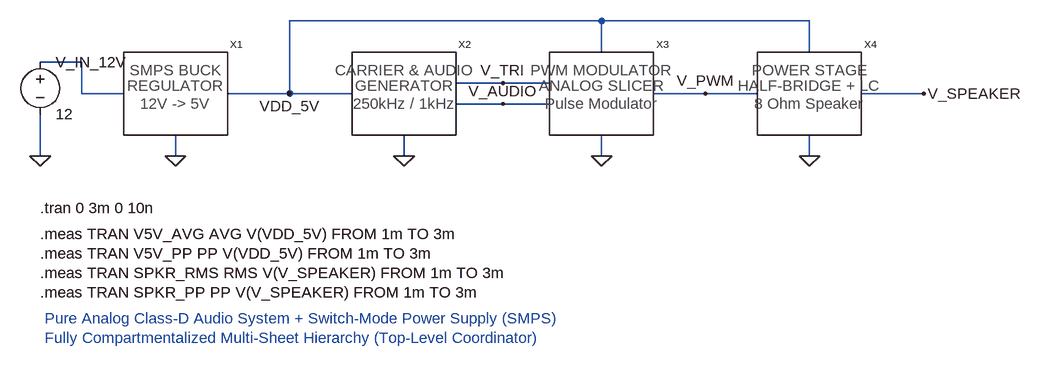
[diagram p0: schematic top_class_d.asc]
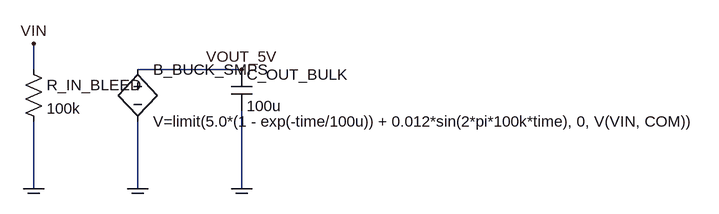
[diagram p1: sub-circuit smps_buck.asc]
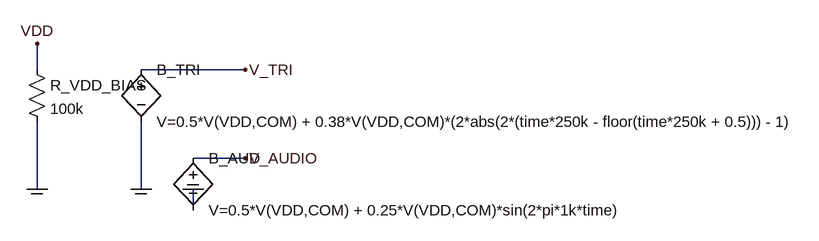
[diagram p2: sub-circuit carrier_gen.asc]
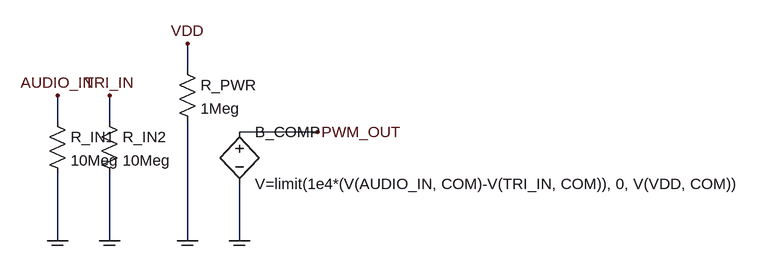
[diagram p3: sub-circuit pwm_modulator.asc]
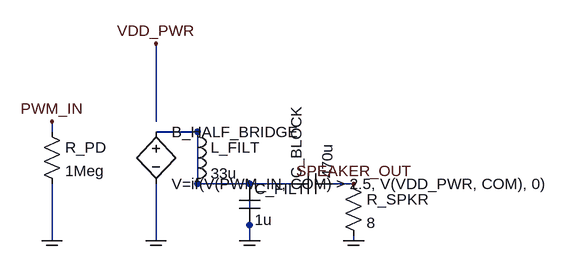
[diagram p4: sub-circuit power_stage.asc]
top_class_d.asc, the LTspice schematic file:
Version 4
SHEET 1 1600 1000
WIRE 80 256 144 256
WIRE 144 256 144 304
WIRE 144 304 208 304
SYMBOL voltage 80 240 R0
SYMATTR InstName V_IN_12V
SYMATTR Value 12
WIRE 80 336 80 400
FLAG 80 400 0
SYMBOL smps_buck 288 304 R0
SYMATTR InstName X1
WIRE 288 368 288 400
FLAG 288 400 0
WIRE 368 304 464 304
FLAG 464 304 VDD_5V
WIRE 464 304 560 304
SYMBOL carrier_gen 640 304 R0
SYMATTR InstName X2
WIRE 640 368 640 400
FLAG 640 400 0
WIRE 720 288 864 288
FLAG 792 288 V_TRI
WIRE 720 320 864 320
FLAG 792 320 V_AUDIO
WIRE 944 240 944 192
WIRE 944 192 464 192
WIRE 464 192 464 304
SYMBOL pwm_modulator 944 304 R0
SYMATTR InstName X3
WIRE 944 368 944 400
FLAG 944 400 0
WIRE 1024 304 1184 304
FLAG 1104 304 V_PWM
WIRE 1264 240 1264 192
WIRE 1264 192 944 192
SYMBOL power_stage 1264 304 R0
SYMATTR InstName X4
WIRE 1264 368 1264 400
FLAG 1264 400 0
WIRE 1344 304 1440 304
FLAG 1440 304 V_SPEAKER
TEXT 80 480 Left 2 !.tran 0 3m 0 10n
TEXT 80 520 Left 2 !.meas TRAN V5V_AVG AVG V(VDD_5V) FROM 1m TO 3m
TEXT 80 550 Left 2 !.meas TRAN V5V_PP PP V(VDD_5V) FROM 1m TO 3m
TEXT 80 580 Left 2 !.meas TRAN SPKR_RMS RMS V(V_SPEAKER) FROM 1m TO 3m
TEXT 80 610 Left 2 !.meas TRAN SPKR_PP PP V(V_SPEAKER) FROM 1m TO 3m
TEXT 80 650 Left 2 ; Pure Analog Class-D Audio System + Switch-Mode Power Supply (SMPS)
TEXT 80 680 Left 2 ; Fully Compartmentalized Multi-Sheet Hierarchy (Top-Level Coordinator)

smps_buck.asc, the sub-circuit schematic file:
Version 4
SHEET 1 1200 800
FLAG 160 160 VIN
FLAG 480 200 VOUT_5V
FLAG 160 384 COM
FLAG 320 384 COM
FLAG 480 384 COM
WIRE 160 160 160 200
SYMBOL res 144 184 R0
SYMATTR InstName R_IN_BLEED
SYMATTR Value 100k
WIRE 160 280 160 384
SYMBOL bv 320 184 R0
SYMATTR InstName B_BUCK_SMPS
SYMATTR Value V=limit(5.0*(1 - exp(-time/100u)) + 0.012*sin(2*pi*100k*time), 0, V(VIN, COM))
WIRE 320 200 480 200
WIRE 320 280 320 384
SYMBOL cap 464 200 R0
SYMATTR InstName C_OUT_BULK
SYMATTR Value 100u
WIRE 480 264 480 384

carrier_gen.asc, the sub-circuit schematic file:
Version 4
SHEET 1 1200 800
FLAG 160 160 VDD
FLAG 160 384 COM
FLAG 480 200 V_TRI
FLAG 480 336 V_AUDIO
FLAG 320 384 COM
FLAG 400 384 COM
SYMBOL res 144 184 R0
SYMATTR InstName R_VDD_BIAS
SYMATTR Value 100k
WIRE 160 160 160 200
WIRE 160 280 160 384
SYMBOL bv 320 184 R0
SYMATTR InstName B_TRI
SYMATTR Value V=0.5*V(VDD,COM) + 0.38*V(VDD,COM)*(2*abs(2*(time*250k - floor(time*250k + 0.5))) - 1)
WIRE 320 200 480 200
WIRE 320 280 320 384
SYMBOL bv 400 320 R0
SYMATTR InstName B_AUD
SYMATTR Value V=0.5*V(VDD,COM) + 0.25*V(VDD,COM)*sin(2*pi*1k*time)
WIRE 400 336 480 336
WIRE 400 416 400 384

pwm_modulator.asc, the sub-circuit schematic file:
Version 4
SHEET 1 1200 800
FLAG 160 160 AUDIO_IN
FLAG 240 160 TRI_IN
FLAG 360 80 VDD
FLAG 160 384 COM
FLAG 240 384 COM
FLAG 360 384 COM
FLAG 560 216 PWM_OUT
SYMBOL res 144 184 R0
SYMATTR InstName R_IN1
SYMATTR Value 10Meg
WIRE 160 160 160 200
WIRE 160 280 160 384
SYMBOL res 224 184 R0
SYMATTR InstName R_IN2
SYMATTR Value 10Meg
WIRE 240 160 240 200
WIRE 240 280 240 384
SYMBOL res 344 104 R0
SYMATTR InstName R_PWR
SYMATTR Value 1Meg
WIRE 360 80 360 120
WIRE 360 200 360 384
SYMBOL bv 440 200 R0
SYMATTR InstName B_COMP
SYMATTR Value V=limit(1e4*(V(AUDIO_IN, COM)-V(TRI_IN, COM)), 0, V(VDD, COM))
WIRE 440 216 560 216
WIRE 440 296 440 384
FLAG 440 384 COM

power_stage.asc, the sub-circuit schematic file:
Version 4
SHEET 1 1400 800
FLAG 160 200 PWM_IN
FLAG 320 80 VDD_PWR
FLAG 160 384 COM
FLAG 320 384 COM
FLAG 464 384 COM
FLAG 624 384 COM
FLAG 624 296 SPEAKER_OUT
SYMBOL res 144 200 R0
SYMATTR InstName R_PD
SYMATTR Value 1Meg
WIRE 160 200 160 216
WIRE 160 296 160 384
WIRE 320 80 320 200
SYMBOL bv 320 200 R0
SYMATTR InstName B_HALF_BRIDGE
SYMATTR Value V=if(V(PWM_IN, COM) > 2.5, V(VDD_PWR, COM), 0)
WIRE 320 216 384 216
WIRE 320 296 320 384
SYMBOL ind 368 200 R0
SYMATTR InstName L_FILT
SYMATTR Value 33u
WIRE 384 216 384 296
WIRE 384 296 464 296
SYMBOL cap 448 296 R0
SYMATTR InstName C_FILT
SYMATTR Value 1u
WIRE 464 296 464 360
WIRE 464 360 464 384
WIRE 464 296 528 296
SYMBOL cap 528 312 R270
SYMATTR InstName C_BLOCK
SYMATTR Value 470u
WIRE 592 296 624 296
SYMBOL res 608 280 R0
SYMATTR InstName R_SPKR
SYMATTR Value 8
WIRE 624 376 624 384

The netlist it stands for:
* top_class_d.asc
V_IN_12V N001 0 12
XX1 N001 0 VDD_5V smps_buck
XX2 VDD_5V 0 V_TRI V_AUDIO carrier_gen
XX3 V_TRI V_AUDIO VDD_5V 0 V_PWM pwm_modulator
XX4 V_PWM VDD_5V 0 V_SPEAKER power_stage

* block symbol definitions
.subckt smps_buck VIN COM VOUT_5V
R_IN_BLEED VIN COM 100k
B_BUCK_SMPS VOUT_5V COM V=limit(5.0*(1 - exp(-time/100u)) + 0.012*sin(2*pi*100k*time), 0, V(VIN, COM))
C_OUT_BULK VOUT_5V COM 100u
.ends smps_buck

.subckt carrier_gen VDD COM V_TRI V_AUDIO
R_VDD_BIAS VDD COM 100k
B_TRI V_TRI COM V=0.5*V(VDD,COM) + 0.38*V(VDD,COM)*(2*abs(2*(time*250k - floor(time*250k + 0.5))) - 1)
B_AUD V_AUDIO COM V=0.5*V(VDD,COM) + 0.25*V(VDD,COM)*sin(2*pi*1k*time)
.ends carrier_gen

.subckt pwm_modulator AUDIO_IN TRI_IN VDD COM PWM_OUT
R_IN1 AUDIO_IN COM 10Meg
R_IN2 TRI_IN COM 10Meg
R_PWR VDD COM 1Meg
B_COMP PWM_OUT COM V=limit(1e4*(V(AUDIO_IN, COM)-V(TRI_IN, COM)), 0, V(VDD, COM))
.ends pwm_modulator

.subckt power_stage PWM_IN VDD_PWR COM SPEAKER_OUT
R_PD PWM_IN COM 1Meg
B_HALF_BRIDGE COM COM V=if(V(PWM_IN, COM) > 2.5, V(VDD_PWR, COM), 0)
L_FILT COM COM 33u
C_FILT COM COM 1u
C_BLOCK COM SPEAKER_OUT 470u
R_SPKR SPEAKER_OUT COM 8
.ends power_stage

.tran 0 3m 0 10n
.meas TRAN V5V_AVG AVG V(VDD_5V) FROM 1m TO 3m
.meas TRAN V5V_PP PP V(VDD_5V) FROM 1m TO 3m
.meas TRAN SPKR_RMS RMS V(V_SPEAKER) FROM 1m TO 3m
.meas TRAN SPKR_PP PP V(V_SPEAKER) FROM 1m TO 3m
*  Pure Analog Class-D Audio System + Switch-Mode Power Supply (SMPS)
*  Fully Compartmentalized Multi-Sheet Hierarchy (Top-Level Coordinator)
.backanno
.end